# Altium schematic sheet ARIKPO.SchDoc
size A
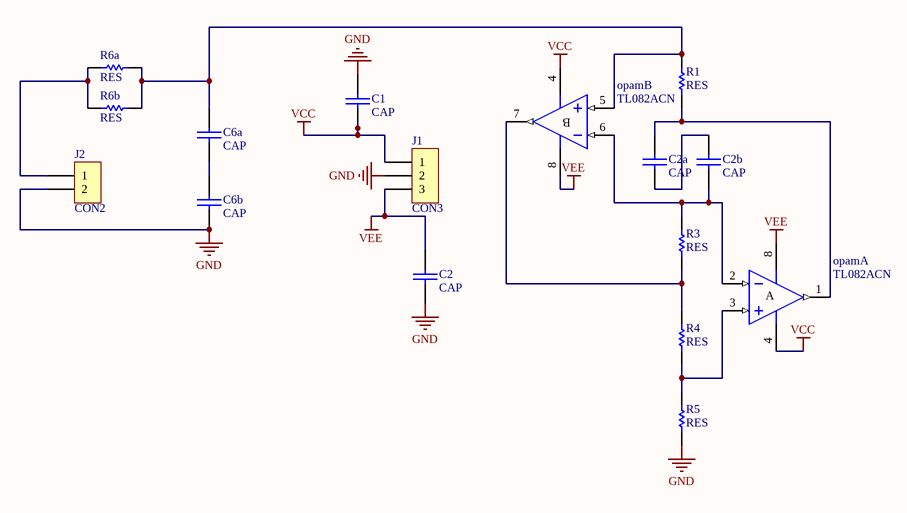
[diagram p0: ARIKPO.SchDoc]

## Parts
C1  CAP  [CAP200]
C2  CAP  [CAP200]
C2a  CAP  [CAP200]
C2b  CAP  [CAP200]
C6a  CAP  [CAP200]
C6b  CAP  [CAP200]
J1  CON3  [SIP3]
J2  CON2  [SIP2]
opam  TL082ACN  [DIP8]  (parts A,B of 2)
R1  RES  [RES300]
R3  RES  [RES300]
R4  RES  [RES300]
R5  RES  [RES300]
R6a  RES  [RES300]
R6b  RES  [RES300]

## Nets
GND: C1.1 C2.2 C6b.2 J1.2 J2.2 R5.1
VCC: C1.2 J1.1 opam.4(V-)
VEE: C2.1 J1.3 opam.8(V+)
NetC2a_1: C2a.1 opam.1(OUT) R1.1
NetC2a_2: C2a.2 C2b.1
NetC2b_2: C2b.2 opam.2(IN-) opam.6(IN-) R3.2
NetC6a_1: C6a.1 opam.5(IN+) R1.2 R6a.2 R6b.2
NetC6a_2: C6a.2 C6b.1
NetJ2_1: J2.1 R6a.1 R6b.1
Netopam_3: opam.3(IN+) R4.1 R5.2
Netopam_7: opam.7(OUT) R3.1 R4.2

## Notes on the sheet
- (in symbol TL082ACN, part A) A
- (in symbol TL082ACN, part B) B

## Library data of the parts
opam = TL082ACN: General-Purpose J-FET Dual Operational Amplifier; Published: 24-Aug-2001; LatestRevisionDate: 06-Jun-2005; LatestRevisionNote: Stylized 3D Model Added.; DatasheetVersion: Jan-1999; PackageReference: DIP8; Publisher: Altium Limited; PackageDescription: DIP; 8 Leads; Row Spacing 7.62 mm; Pitch 2.54 mm; Code_JEDEC: MO-001-AN; ComponentLink1Description: Manufacturer Link; ComponentLink1URL: http://www.st.com/; ComponentLink2Description: Datasheet; ComponentLink2URL: http://www.st.com/stonline/products/literature/ds/2300/tl082.pdf